# Altium schematic sheet power.SchDoc
size A4; SheetNumber: 1; SheetTotal: 2
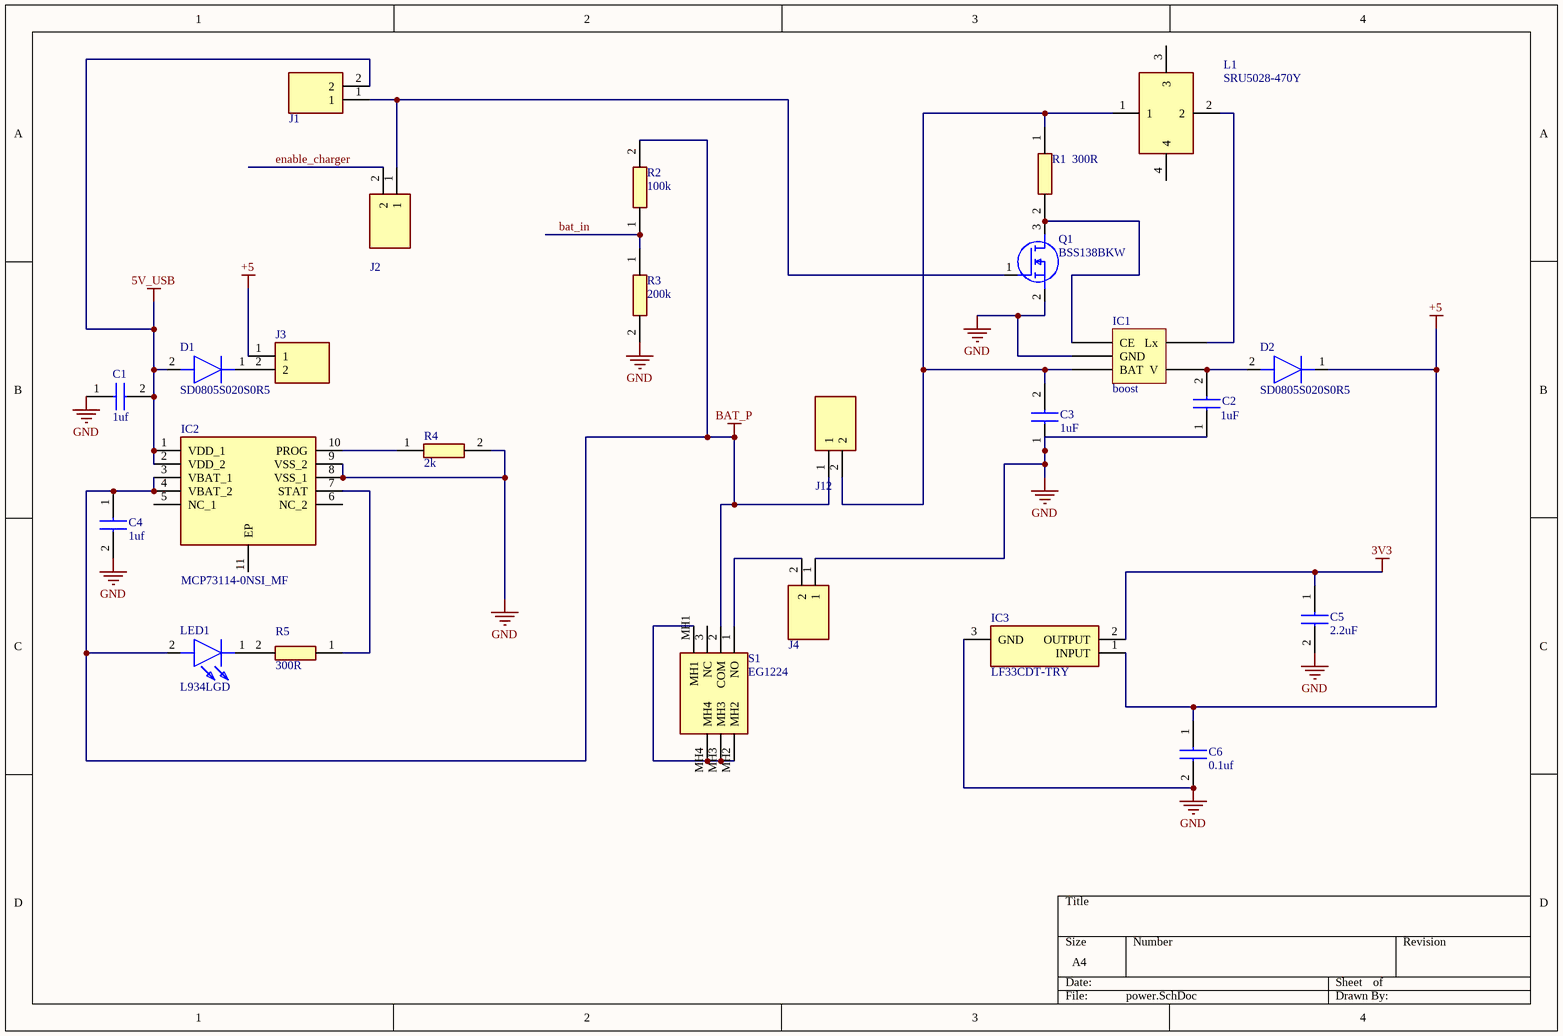
[diagram p0: power.SchDoc]

## Parts
C1  1uf  [C0805]
C2  1uF  [CAPC2114X145N]
C3  1uF  [CAPC2114X145N]
C4  1uf  [C0805]
C5  2.2uF  [CAPC2012X152N]
C6  0.1uf  [C0805]
D1  SD0805S020S0R5  [DIOC2013X100N]
D2  SD0805S020S0R5  [DIOC2013X100N]
IC1  boost  [SOT95P280X110-5N]
IC2  MCP73114-0NSI_MF  [SON50P300X300X100-11N-D]
IC3  LF33CDT-TRY  [LD1117DT33]
J1  10129378-902001BLF  [HDRV2W67P0X254_1X2_508X241X843P]  (value not drawn)
J2  10129378-902001BLF  [HDRV2W67P0X254_1X2_508X241X843P]  (value not drawn)
J3  10129378-902001BLF  [HDRV2W67P0X254_1X2_508X241X843P]  (value not drawn)
J4  10129378-902001BLF  [HDRV2W67P0X254_1X2_508X241X843P]  (value not drawn)
J12  10129378-902001BLF  [HDRV2W67P0X254_1X2_508X241X843P]  (value not drawn)
L1  SRU5028-470Y  [SRU5028]
LED1  L934LGD  [L934LGD]
Q1  BSS138BKW  [SOT65P210X110-3N]
R1  300R  [RESC2012X65N]
R2  100k  [RESC2012X60N]
R3  200k  [RESC2012X65N]
R4  2k  [RESC2012X65N]
R5  300R  [RESC2012X65N]
S1  EG1224  [EG1224]

## Nets
3V3: C5.1 IC3.2(OUTPUT)
5V_USB: C1.2 D1.2(A) IC2.1(VDD_1) IC2.2(VDD_2) J1.2
+5: C6.1 D2.1(K) IC3.1(INPUT) J3.1
BAT_P: C4.1 IC2.3(VBAT_1) IC2.4(VBAT_2) J12.1 LED1.2(A) R2.2 S1.2(COM)
GND: C1.1 C2.1 C3.1 C4.2 C5.2 C6.2 IC1.2(GND) IC2.8(VSS_1) IC2.9(VSS_2) IC3.3(GND) J4.1 Q1.2(S) R3.2 R4.2
bat_in: R2.1 R3.1
enable_charger: J2.2
NetC2_2: C2.2 D2.2(A) IC1.4(V)
NetC3_2: C3.2 IC1.3(BAT) J12.2 L1.1 R1.1
NetD1_1: D1.1(K) J3.2
NetIC1_1: IC1.1(CE) Q1.3(D) R1.2
NetIC1_5: IC1.5(Lx) L1.2
NetIC2_7: IC2.7(STAT) R5.1
NetIC2_10: IC2.10(PROG) R4.1
NetJ1_1: J1.1 J2.1 Q1.1(G)
NetJ4_2: J4.2 S1.1(NO)
NetLED1_1: LED1.1(K) R5.2
NetS1_MH1: S1.MH1 S1.MH2 S1.MH3 S1.MH4

Not connected (* = marked no-connect by the designer): IC2 5(NC_1) 6(NC_2) 11(EP); L1 3 4; S1 3(NC)

## Library data of the parts
C1 C4 C6 = C0805C104J5RACTM: Capacitor; Manufacturer_Name: KEMET; Datasheet Link: https://content.kemet.com/datasheets/KEM_C1002_X7R_SMD.pdf; Height: 1.1mm; Manufacturer_Part_Number: C0805C104J5RACTM
C2 C3 = LMR212BD7106KG-T: Capacitor; Manufacturer_Name: TAIYO YUDEN; Datasheet Link: https://www.mouser.de/datasheet/2/396/TAIY_S_A0012830329_1-2514546.pdf; Height: 1.45mm; Manufacturer_Part_Number: LMR212BD7106KG-T; Mouser Part Number: 963-LMR212BD7106KG-T; Mouser Price/Stock: https://www.mouser.co.uk/ProductDetail/Taiyo-Yuden/LMR212BD7106KG-T?qs=DRkmTr78QATXuUQGmCCYPQ%3D%3D
C5 = 08055C225KAT2A: Capacitor; Manufacturer_Name: AVX; Datasheet Link: http://datasheets.avx.com/X7RDielectric.pdf; Height: 1.52mm; Manufacturer_Part_Number: 08055C225KAT2A; Mouser Part Number: 581-08055C225KAT2A; Mouser Price/Stock: https://www.mouser.co.uk/ProductDetail/AVX/08055C225KAT2A?qs=F5vmRhUsTTrD4i7cuGJbzw%3D%3D; Arrow Part Number: 08055C225KAT2A; Arrow Price/Stock: https://www.arrow.com/en/products/08055c225kat2a/avx
D1 D2 = SD0805S020S0R5: Diode; Manufacturer_Name: AVX; Datasheet Link: https://datasheets.kyocera-avx.com/schottky.pdf; Height: 1mm; Manufacturer_Part_Number: SD0805S020S0R5; Mouser Part Number: 581-SD0805S020S0R5; Mouser Price/Stock: https://www.mouser.co.uk/ProductDetail/AVX/SD0805S020S0R5?qs=jCA%252BPfw4LHZ%252BeTNuLGlRmA%3D%3D; Arrow Part Number: SD0805S020S0R5; Arrow Price/Stock: https://www.arrow.com/en/products/sd0805s020s0r5/avx
IC2 = MCP73114-0NSI_MF: Integrated Circuit; Manufacturer_Name: Microchip; Manufacturer_Part_Number: MCP73114-0NSI/MF; Datasheet Link: http://ww1.microchip.com/downloads/en/DeviceDoc/20002183E.pdf; Height: 1mm; Mouser Part Number: 579-MCP73114-0NSI/MF; Mouser Price/Stock: https://www.mouser.co.uk/ProductDetail/Microchip-Technology/MCP73114-0NSI-MF?qs=E6wAi2XWqcO2fCdY3OHx7w%3D%3D; Arrow Part Number: MCP73114-0NSI/MF; Arrow Price/Stock: https://www.arrow.com/en/products/mcp73114-0nsimf/microchip-technology
IC3 = LF33CDT-TRY: Integrated Circuit; Manufacturer_Name: STMicroelectronics; Datasheet Link: https://www.st.com/resource/en/datasheet/lfxx.pdf; Height: 2mm; Manufacturer_Part_Number: LF33CDT-TRY; Mouser Part Number: 511-LF33CDT-TRY; Mouser Price/Stock: https://www.mouser.co.uk/ProductDetail/STMicroelectronics/LF33CDT-TRY?qs=fnYUjNMxfVBCqlsIwZoKRw%3D%3D; Arrow Part Number: LF33CDT-TRY; Arrow Price/Stock: https://www.arrow.com/en/products/lf33cdt-try/stmicroelectronics?region=nac
J1-J4 J12 = 10129378-902001BLF: Connector; Manufacturer_Name: Amphenol; Datasheet Link: https://www.mouser.co.uk/datasheet/2/18/10129378-1530218.pdf; Height: 8.43mm; Manufacturer_Part_Number: 10129378-902001BLF; Mouser Part Number: 649-1012937890201BLF; Mouser Price/Stock: https://www.mouser.co.uk/ProductDetail/Amphenol-FCI/10129378-902001BLF?qs=0lQeLiL1qybv6C1q0T3%2FPw%3D%3D; Arrow Part Number: 10129378-902001BLF; Arrow Price/Stock: https://www.arrow.com/en/products/10129378-902001blf/amphenol-fci?region=nac
L1 = SRU5028-470Y: Inductor; Manufacturer_Name: Bourns; Datasheet Link: https://www.bourns.com/docs/Product-Datasheets/SRU5028.pdf; Manufacturer_Part_Number: SRU5028-470Y; Mouser Part Number: 652-SRU5028-470Y; Mouser Price/Stock: https://www.mouser.co.uk/ProductDetail/Bourns/SRU5028-470Y?qs=q9ZR8LvBB%2Fv3savKPF%252BPQg%3D%3D; Arrow Part Number: SRU5028-470Y; Arrow Price/Stock: https://www.arrow.com/en/products/sru5028-470y/bourns?region=nac
LED1 = L934LGD: LED; Manufacturer_Name: Kingbright; Datasheet Link: https://www.datasheetq.com/datasheet-download/128932/1/Kingbright/L934LGD; Height: 5.65mm; Manufacturer_Part_Number: L934LGD; Mouser Part Number: 604-L934LGD; Mouser Price/Stock: https://www.mouser.co.uk/ProductDetail/Kingbright/L934LGD?qs=JpELLRhtMc0h5yVTzmoC8Q%3D%3D
Q1 = BSS138BKW: MOSFET (N-Channel); Manufacturer_Name: Nexperia; Datasheet Link: https://datasheet.datasheetarchive.com/originals/distributors/Datasheets-NXP/DSANXP010002283.pdf; Height: 1.1mm; Manufacturer_Part_Number: BSS138BKW; Mouser Part Number: N/A; Mouser Price/Stock: https://www.mouser.com/Search/Refine.aspx?Keyword=N%2FA
R1 R5 = CPF0805B300RE1: Resistor; Manufacturer_Name: TE Connectivity; Datasheet Link: https://datasheet.datasheetarchive.com/originals/distributors/DKDS-21/401696.pdf; Height: 0.65mm; Manufacturer_Part_Number: CPF0805B300RE1; Mouser Part Number: 279-CPF0805B300RE1; Mouser Price/Stock: https://www.mouser.co.uk/ProductDetail/TE-Connectivity-Holsworthy/CPF0805B300RE1?qs=9ylKvqdyudms1bwrHl3aqw%3D%3D; Arrow Part Number: CPF0805B300RE1; Arrow Price/Stock: https://www.arrow.com/en/products/cpf0805b300re1/te-connectivity
R2 = CRCW0805100KFKEAHP: Resistor; Manufacturer_Name: Vishay; Datasheet Link: https://componentsearchengine.com/Datasheets/1/CRCW08051R00FKEAHP.pdf; Height: 0.6mm; Manufacturer_Part_Number: CRCW0805100KFKEAHP; Mouser Part Number: 71-CRCW0805100KFKEAH; Mouser Price/Stock: https://www.mouser.co.uk/ProductDetail/Vishay-Dale/CRCW0805100KFKEAHP?qs=k2%2FDWSARqgFvzezk%252B9pwaw%3D%3D; Arrow Part Number: CRCW0805100KFKEAHP; Arrow Price/Stock: https://www.arrow.com/en/products/crcw0805100kfkeahp/vishay?region=nac
R3 = CPF0805B200KE: Resistor; Manufacturer_Name: TE Connectivity; Datasheet Link: https://datasheet.datasheetarchive.com/originals/distributors/Datasheets_SAMA/2fea3103b7d103f8f6e5715885d434f0.pdf; Height: 0.65mm; Manufacturer_Part_Number: CPF0805B200KE
R4 = CPF0805B2K1E: Resistor; Manufacturer_Name: TE Connectivity; Height: 0.65mm; Manufacturer_Part_Number: CPF0805B2K1E; Mouser Part Number: N/A; Mouser Price/Stock: https://www.mouser.co.uk/ProductDetail/TE-Connectivity-Neohm/CPF0805B2K1E?qs=chTDxNqvsylAMDxdeLsX9w%3D%3D
S1 = EG1224: Switch; Manufacturer_Name: E-Switch; Datasheet Link: http://www.mouser.com/datasheet/2/140/EG-345873.pdf; Height: 8.5mm; Manufacturer_Part_Number: EG1224; Mouser Part Number: 612-EG1224; Mouser Price/Stock: https://www.mouser.co.uk/ProductDetail/E-Switch/EG1224?qs=HKd%2Fp3M7KlUMARNITVNimA%3D%3D